# EAGLE schematic expansion (EAGLE 9.6.2)
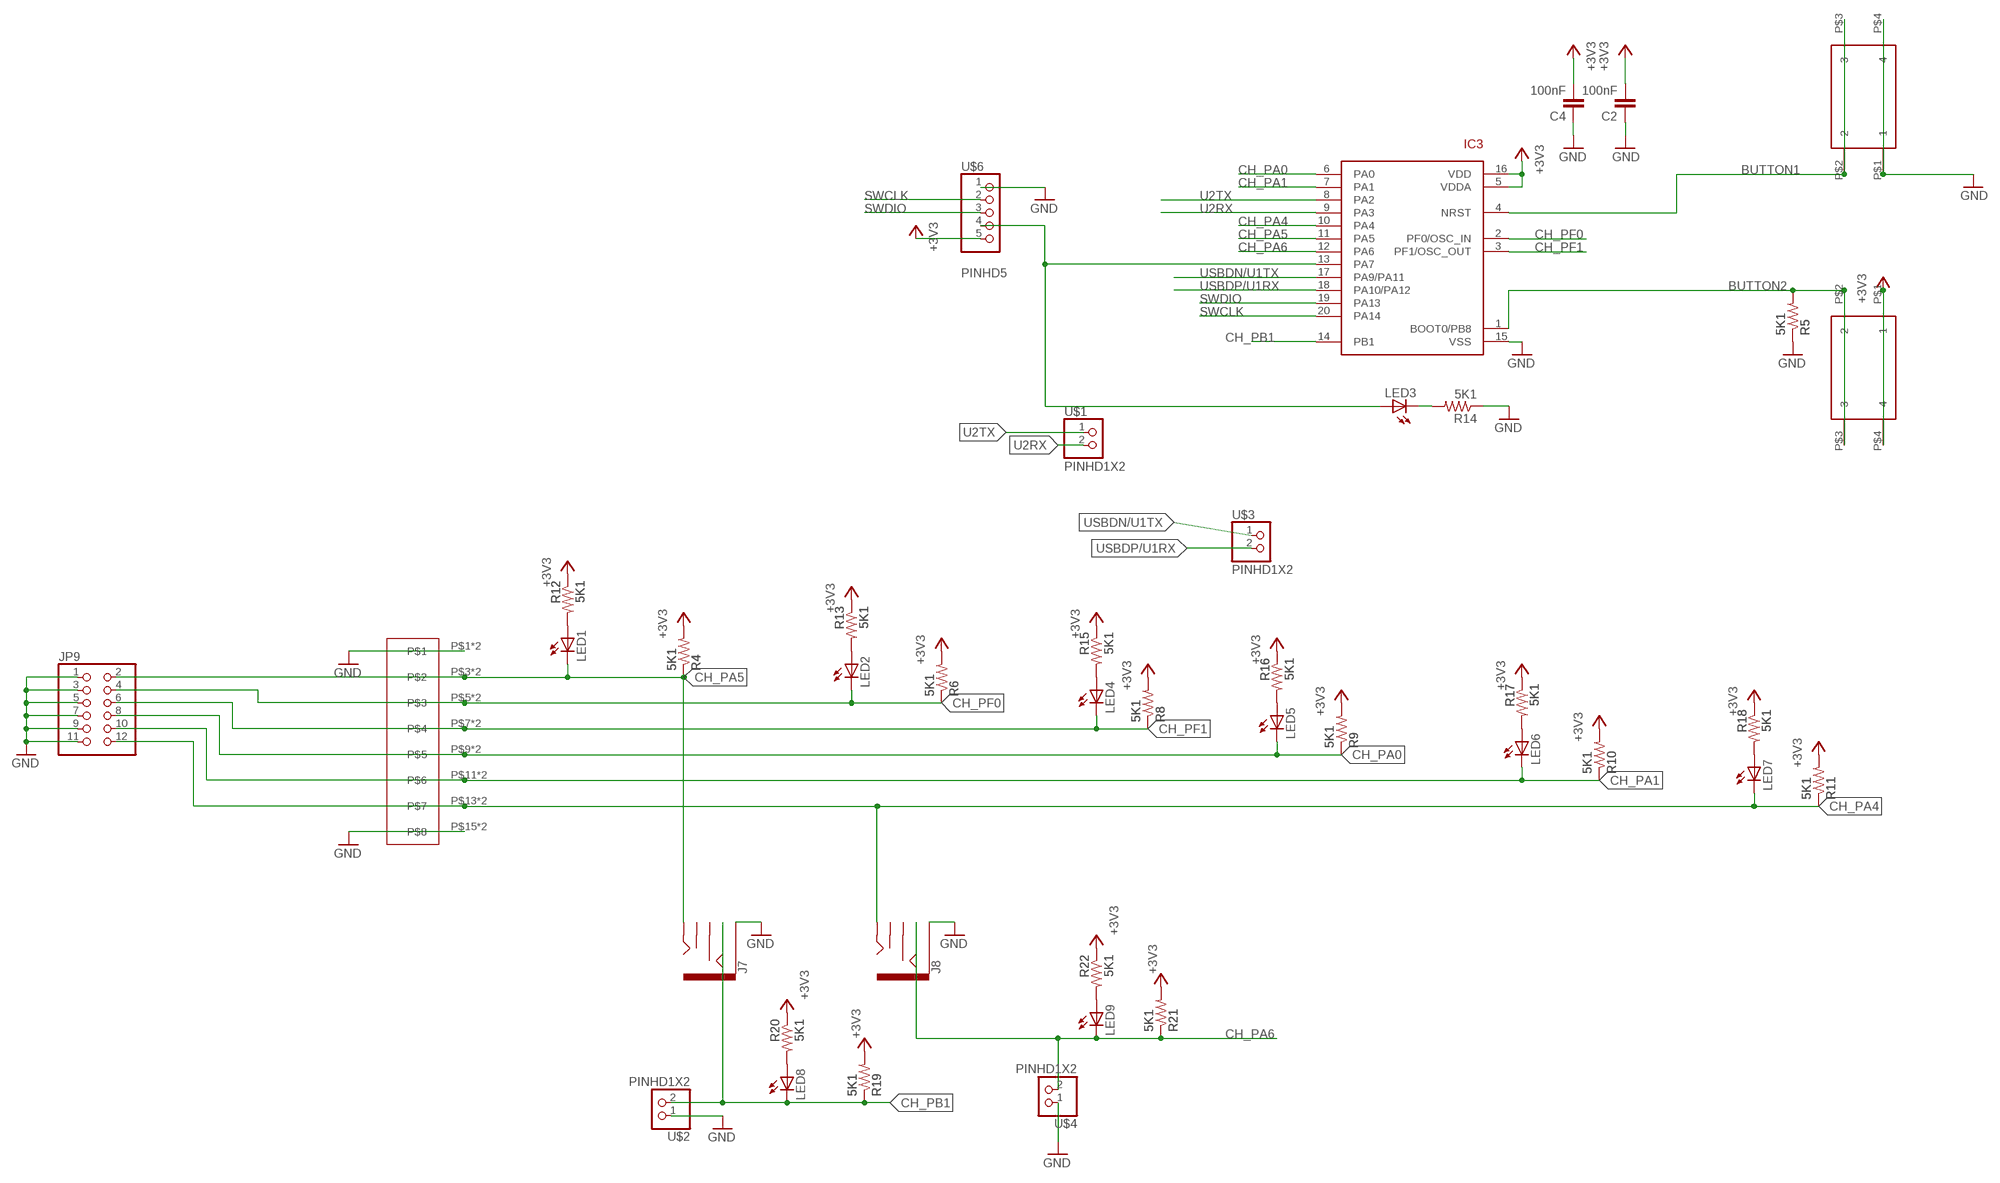
[diagram p0: schematic, sheet 1, part 1 of 2]
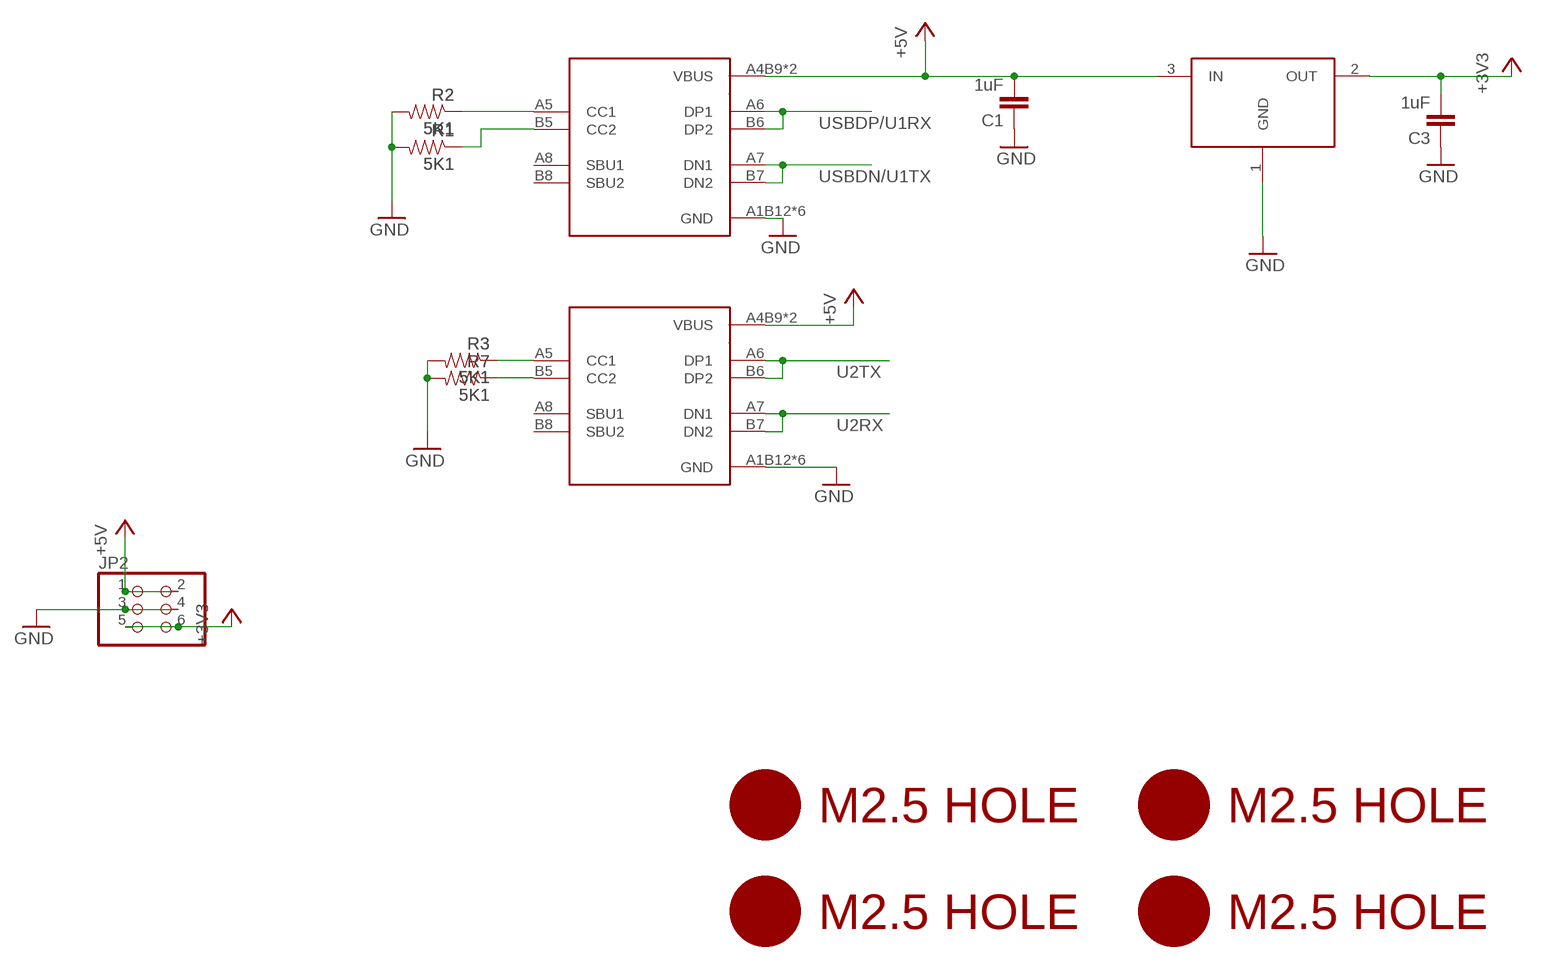
[diagram p1: schematic, sheet 1, part 2 of 2]

## Parts
C1  1uF  CAP0805  [0805]
C2  100nF  CAP0805  [0805]
C3  1uF  CAP0805  [0805]
C4  100nF  CAP0805  [0805]
IC3  STM32F042F4  [TSSOP20]
J7  AUDIO_JACK_3.5MM_PTH  [AUDIO-JACK]
J8  AUDIO_JACK_3.5MM_PTH  [AUDIO-JACK]
JP2  PINHD-2X3  [2X03]
JP9  PINHD-2X6  [2X06]
LED1  LEDCHIP-LED0805  [CHIP-LED0805]
LED2  LEDCHIP-LED0805  [CHIP-LED0805]
LED3  LEDCHIP-LED0805  [CHIP-LED0805]
LED4  LEDCHIP-LED0805  [CHIP-LED0805]
LED5  LEDCHIP-LED0805  [CHIP-LED0805]
LED6  LEDCHIP-LED0805  [CHIP-LED0805]
LED7  LEDCHIP-LED0805  [CHIP-LED0805]
LED8  LEDCHIP-LED0805  [CHIP-LED0805]
LED9  LEDCHIP-LED0805  [CHIP-LED0805]
R1  5K1  RESISTOR0805-RES  [0805]
R2  5K1  RESISTOR0805-RES  [0805]
R3  5K1  RESISTOR0805-RES  [0805]
R4  5K1  RESISTOR0805-RES  [0805]
R5  5K1  RESISTOR0805-RES  [0805]
R6  5K1  RESISTOR0805-RES  [0805]
R7  5K1  RESISTOR0805-RES  [0805]
R8  5K1  RESISTOR0805-RES  [0805]
R9  5K1  RESISTOR0805-RES  [0805]
R10  5K1  RESISTOR0805-RES  [0805]
R11  5K1  RESISTOR0805-RES  [0805]
R12  5K1  RESISTOR0805-RES  [0805]
R13  5K1  RESISTOR0805-RES  [0805]
R14  5K1  RESISTOR0805-RES  [0805]
R15  5K1  RESISTOR0805-RES  [0805]
R16  5K1  RESISTOR0805-RES  [0805]
R17  5K1  RESISTOR0805-RES  [0805]
R18  5K1  RESISTOR0805-RES  [0805]
R19  5K1  RESISTOR0805-RES  [0805]
R20  5K1  RESISTOR0805-RES  [0805]
R21  5K1  RESISTOR0805-RES  [0805]
R22  5K1  RESISTOR0805-RES  [0805]
SW3  324_SW  [342_SWICH_FOOT]
SW4  324_SW  [342_SWICH_FOOT]
U1  USBC_16P  [USBC_16P_FOOT]
U2  USBC_16P  [USBC_16P_FOOT]
U4  XC6206_DEV  [SOT23R_INFINEON]
U$1  PINHD1X2  [1X02]
U$2  PINHD1X2  [1X02]
U$3  PINHD1X2  [1X02]
U$4  PINHD1X2  [1X02]
U$6  PINHD5  [1X05]
U$8  M2.5HOLE  [M2.5HOLE]
U$9  M2.5HOLE  [M2.5HOLE]
U$10  M2.5HOLE  [M2.5HOLE]
U$11  M2.5HOLE  [M2.5HOLE]
U$14  DG2204R-5.0-8DG2204-8  [DG2204R-8]

## Nets
+3V3: C2.2 C3.2 C4.2 IC3.5(VDDA) IC3.16(VDD) JP2.5 JP2.6 R4.2 R6.2 R8.2 R9.2 R10.2 R11.2 R12.1 R13.1 R15.1 R16.1 R17.1 R18.1 R19.2 R20.1 R21.2 R22.1 SW4.P$1 SW4.P$4 U4.2(OUT) U$6.5
+5V: C1.2 JP2.1 JP2.2 U1.A4B9(VBUS) U1.B4A9(VBUS) U2.A4B9(VBUS) U2.B4A9(VBUS) U4.3(IN)
BUTTON1: IC3.4(NRST) SW3.P$2 SW3.P$3
BUTTON2: IC3.1(BOOT0/PB8) R5.2 SW4.P$2 SW4.P$3
CH_PA0: IC3.6(PA0) JP9.8 LED5.C R9.1 U$14.P$9 U$14.P$10
CH_PA1: IC3.7(PA1) JP9.10 LED6.C R10.1 U$14.P$11 U$14.P$12
CH_PA4: IC3.10(PA4) J8.TIP JP9.12 LED7.C R11.1 U$14.P$13 U$14.P$14
CH_PA5: IC3.11(PA5) J7.TIP JP9.2 LED1.C R4.1 U$14.P$3 U$14.P$4
CH_PA6: IC3.12(PA6) J8.RING LED9.C R21.1 U$4.2
CH_PB1: IC3.14(PB1) J7.RING LED8.C R19.1 U$2.2
CH_PF0: IC3.2(PF0/OSC_IN) JP9.4 LED2.C R6.1 U$14.P$5 U$14.P$6
CH_PF1: IC3.3(PF1/OSC_OUT) JP9.6 LED4.C R8.1 U$14.P$7 U$14.P$8
GND: C1.1 C2.1 C3.1 C4.1 IC3.15(VSS) J7.SLEEVE J8.SLEEVE JP2.3 JP2.4 JP9.1 JP9.3 JP9.5 JP9.7 JP9.9 JP9.11 R1.2 R2.2 R3.2 R5.1 R7.2 R14.1 SW3.P$1 SW3.P$4 U1.A1B12(GND) U1.B11A12(GND) U1.P$13(GND) U1.P$14(GND) U1.P$15(GND) U1.P$16(GND) U2.A1B12(GND) U2.B11A12(GND) U2.P$13(GND) U2.P$14(GND) U2.P$15(GND) U2.P$16(GND) U4.1(GND) U$2.1 U$4.1 U$6.1 U$14.P$1 U$14.P$2 U$14.P$15 U$14.P$16
N$1: R3.1 U1.A5(CC1)
N$2: R7.1 U1.B5(CC2)
N$3: LED1.A R12.2
N$4: LED2.A R13.2
N$5: LED4.A R15.2
N$6: LED5.A R16.2
N$7: LED6.A R17.2
N$8: LED7.A R18.2
N$9: LED8.A R20.2
N$10: IC3.13(PA7) LED3.A U$6.4
N$11: LED3.C R14.2
N$12: LED9.A R22.2
N$31: R1.1 U2.B5(CC2)
N$33: R2.1 U2.A5(CC1)
SWCLK: IC3.20(PA14) U$6.2
SWDIO: IC3.19(PA13) U$6.3
U2RX: IC3.9(PA3) U1.A7(DN1) U1.B7(DN2) U$1.2
U2TX: IC3.8(PA2) U1.A6(DP1) U1.B6(DP2) U$1.1
USBDN/U1TX: IC3.17(PA9/PA11) U2.A7(DN1) U2.B7(DN2) U$3.1
USBDP/U1RX: IC3.18(PA10/PA12) U2.A6(DP1) U2.B6(DP2) U$3.2
Unconnected: J7.RSH J7.TSH J8.RSH J8.TSH U1.A8(SBU1) U1.B8(SBU2) U2.A8(SBU1) U2.B8(SBU2)

## Library data of the parts
C1-C4 = clock:CAP: Capacitor Standard 0603 ceramic capacitor, and 0.1" leaded capacitor.
IC3 = tx:STM32F042F4
J7 J8 = SparkFun-Connectors:AUDIO_JACK_3.5MM: Audio Jack 3.5mm variants of PTH and SMT stereo audio jack with bypass switches. SparkFun Products: SparkFun SparkPunk Sound Kit <[https://www.sparkfun.com/products/11177]> - PTH MP3 Trigger <https://www.sparkfun.com/products/13720> -3.5mm SMD SparkFun PicoBoard <https://www.sparkfun.com/products/11888>- 2.5mm SMD; PROD_ID: CONN-08774; SF_ID: PRT-08032
JP2 = pinhead:PINHD-2X3: PIN HEADER
JP9 = pinhead:PINHD-2X6: PIN HEADER
LED1-LED9 = adafruit:LED: LED OSRAM: - CHIPLED LG R971, LG N971, LY N971, LG Q971, LY Q971, LO R971, LY R971 LH N974, LH R974 LS Q976, LO Q976, LY Q976 LO Q996 - Hyper CHIPLED LW Q18S LB Q993, LB Q99A, LB R99A - SideLED LS A670, LO A670, LY A670, LG A670, LP A670 LB A673, LV A673, LT A673, LW A673 LH A674 LY A675 LS A676, LA A676, LO A676, LY A676, LW A676 LS A679, LY A679, LG A679 - Hyper Micro SIDELED® LS Y876, LA Y876, LO Y876, LY Y876 LT Y87S - SmartLED LW L88C, LW L88S LB L89C, LB L89S, LG L890 LS L89K, LO L89K, LY L89K LS L896, LA L896, LO L896, LY L896 - TOPLED LS T670, LO T670, LY T670, LG T670, LP T670 LSG T670, LSP T670, LSY T670, LOP T670, LYG T670 LG T671, LOG T671, LSG T671 LB T673, LV T673, LT T673, LW T673 LH T674 LS T676, LA T676, LO T676, LY T676, LB T676, LH T676, LSB T676, LW T676 LB T67C, LV T67C, LT T67C, LS T67K, LO T67K, LY T67K, LW E67C LS E67B, LA E67B, LO E67B, LY E67B, LB E67C, LV E67C, LT E67C LW T67C LS T679, LY T679, LG T679 LS T770, LO T770, LY T770, LG T770, LP T770 LB T773, LV T773, LT T773, LW T773 LH T774 LS E675, LA E675, LY E675, LS T675 LS T776, LA T776, LO T776, LY T776, LB T776 LHGB T686 LT T68C, LB T68C - Hyper Mini TOPLED® LB M676 - Mini TOPLED Santana® LG M470 LS M47K, LO M47K, LY M47K Source: http://www.osram.convergy.de/
R1-R13 R15-R22 = joyAnalog:RESISTOR: Resistor Basic schematic elements and footprints for 0603, 1206, and PTH resistors.
R14 = SparkFun-Passives:RESISTOR: Resistor Basic schematic elements and footprints for 0603, 1206, and PTH resistors.
SW3 SW4 = 3pos_slide_switch_centered:324_SW
U1 U2 = my_usbc_16p:USBC_16P
U4 = 3pos_slide_switch:XC6206_DEV
U$1-U$4 = adafruit_changed:PINHD1X2
U$6 = adafruit_changed:PINHD5
U$8-U$11 = f1c100s:M2.5HOLE
U$14 = atx4vc:DG2204R-5.0-8